# Altium schematic sheet 10_AD1.SchDoc
size A4; PageSetup: Record=PageOptions|CenterHorizontal=True|CenterVertical=True|PrintScale=0.97|XCorrection=1.00|YCorrection=1.00|PrintKind=0|BorderSize=5000000|LeftOffset=0|BottomOffset=0|Orientation=2|PaperLength=1000|PaperWidth=1000|Scale=100|PaperSource=7|PrintQuality=-4|MediaType=1|DitherType=10|PaperKind=A4|PrintScaleMode=1
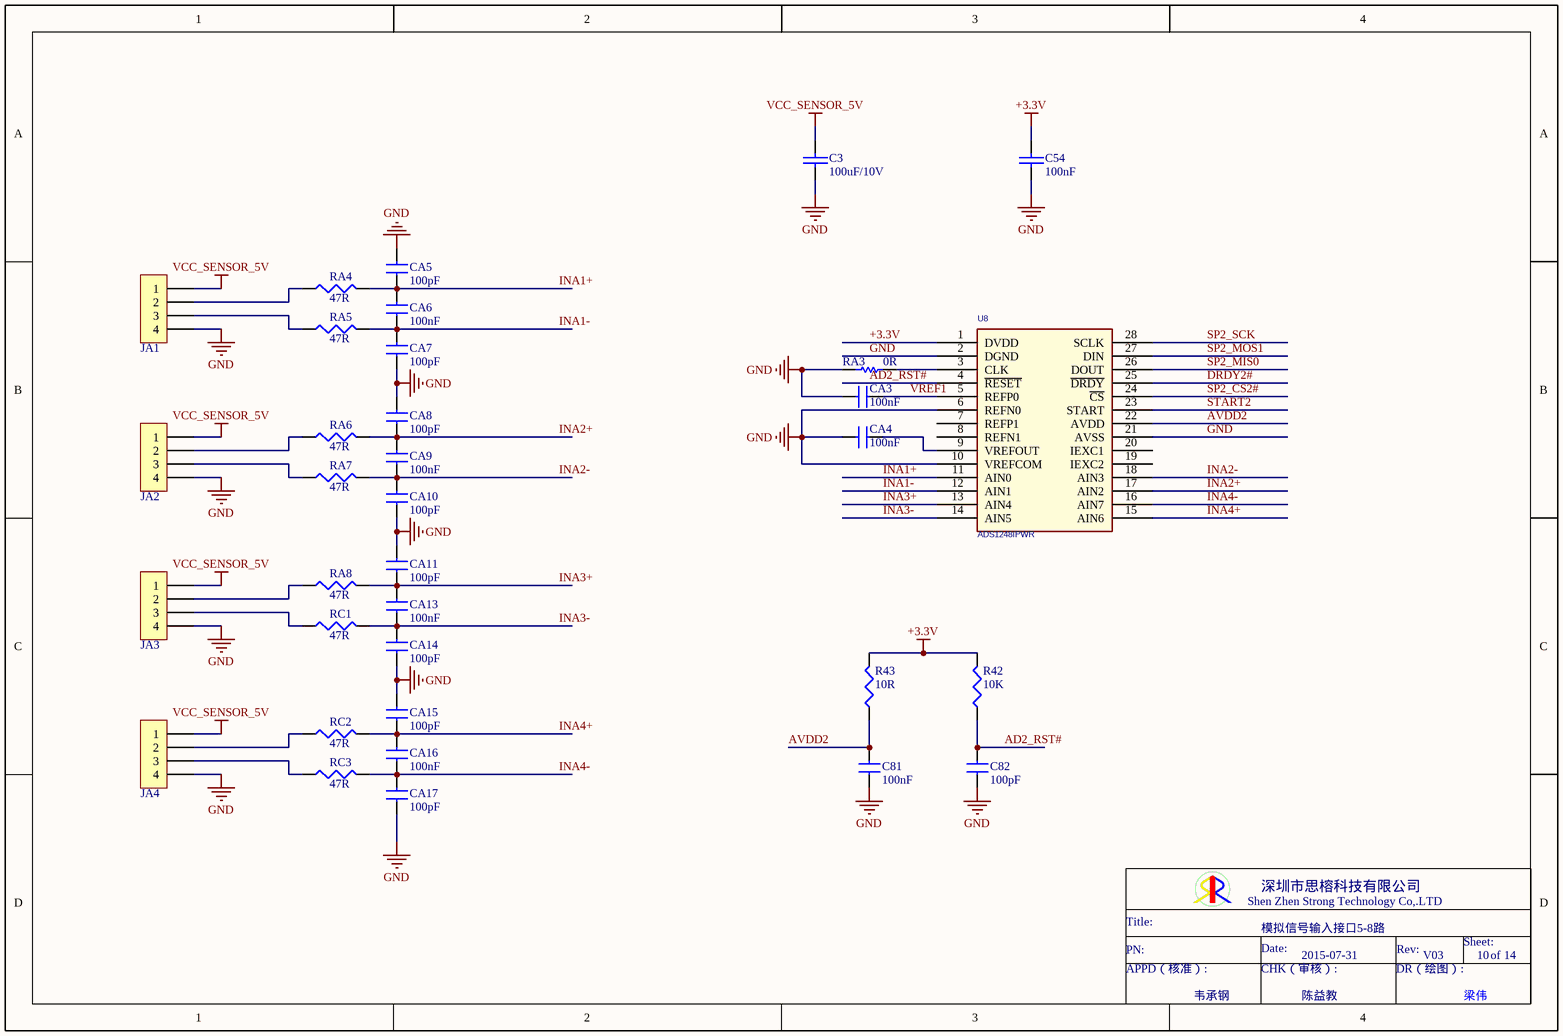
[diagram p0: 10_AD1.SchDoc]

## Parts
C3  100uF/10V  [6032]
C54  100nF  [0603C]
C81  100nF  [0603C]
C82  100pF  [0603C]
CA3  100nF  [0805C]
CA4  100nF  [0805C]
CA5  100pF  [0603C]
CA6  100nF  [0603C]
CA7  100pF  [0603C]
CA8  100pF  [0603C]
CA9  100nF  [0603C]
CA10  100pF  [0603C]
CA11  100pF  [0603C]
CA13  100nF  [0603C]
CA14  100pF  [0603C]
CA15  100pF  [0603C]
CA16  100nF  [0603C]
CA17  100pF  [0603C]
JA1  XH-4A  [CN4-2.54]  (value not drawn)
JA2  XH-4A  [CN4-2.54]  (value not drawn)
JA3  XH-4A  [CN4-2.54]  (value not drawn)
JA4  XH-4A  [CN4-2.54]  (value not drawn)
R42  10K  [0603R]
R43  10R  [0603R]
RA3  0R  [0603R]
RA4  47R  [0603R]
RA5  47R  [0603R]
RA6  47R  [0603R]
RA7  47R  [0603R]
RA8  47R  [0603R]
RC1  47R  [0603R]
RC2  47R  [0603R]
RC3  47R  [0603R]
U8  ADS1248IPWR  [SOIC28]

## Nets
+3.3V: C54.1 R42.2 R43.2 U8.1(DVDD)
GND: C3.2 C54.2 C81.2 C82.2 CA3.2 CA4.2 CA5.1 CA7.2 CA8.1 CA10.2 CA11.1 CA14.2 CA15.1 CA17.2 JA1.4 JA2.4 JA3.4 JA4.4 RA3.1 U8.2(DGND) U8.6(REFN0) U8.10(VREFCOM) U8.21(AVSS)
VCC_SENSOR_5V: C3.1 JA1.1 JA2.1 JA3.1 JA4.1
AD2_RST#: C82.1 R42.1 U8.4(~{RESET})
AVDD2: C81.1 R43.1 U8.22(AVDD)
DRDY2#: U8.25(~{DRDY})
INA1+: CA5.2 CA6.1 RA4.2 U8.11(AIN0)
INA1-: CA6.2 CA7.1 RA5.2 U8.12(AIN1)
INA2+: CA8.2 CA9.1 RA6.2 U8.17(AIN2)
INA2-: CA9.2 CA10.1 RA7.2 U8.18(AIN3)
INA3+: CA11.2 CA13.1 RA8.2 U8.13(AIN4)
INA3-: CA13.2 CA14.1 RC1.2 U8.14(AIN5)
INA4+: CA15.2 CA16.1 RC2.2 U8.15(AIN6)
INA4-: CA16.2 CA17.1 RC3.2 U8.16(AIN7)
SP2_CS2#: U8.24(~{CS})
SP2_MIS0: U8.26(DOUT)
SP2_MOS1: U8.27(DIN)
SP2_SCK: U8.28(SCLK)
START2: U8.23(START)
VREF1: CA3.1 U8.5(REFP0)
NetCA4_1: CA4.1 U8.9(VREFOUT)
NetJA1_2: JA1.2 RA4.1
NetJA1_3: JA1.3 RA5.1
NetJA2_2: JA2.2 RA6.1
NetJA2_3: JA2.3 RA7.1
NetJA3_2: JA3.2 RA8.1
NetJA3_3: JA3.3 RC1.1
NetJA4_2: JA4.2 RC2.1
NetJA4_3: JA4.3 RC3.1
NetRA3_2: RA3.2 U8.3(CLK)

Not connected (* = marked no-connect by the designer): U8 7(REFP1) 8(REFN1) 19(IEXC2) 20(IEXC1)

## Notes on the sheet
- 模拟信号输入接口5-8路
- 2015-07-31
- V03
- 10
- 14
- 韦承钢
- 陈益教
- Shen Zhen Strong Technology Co,.LTD
- 深圳市思榕科技有限公司
- Title:
- PN:
- APPD（核准）:
- Date:
- CHK（审核）:
- DR（绘图）:
- Rev:
- Sheet:
- of
- 梁伟

## Library data of the parts
C3 C54 = CAP: Capacitor
C81 CA3 CA4 CA6 CA9 CA13 CA16 = 电容: Capacitor; Value: 100nF
C82 CA5 CA7 CA8 CA10 CA11 CA14 CA15 CA17 = 电容: Capacitor; Value: 100nF
JA1-JA4 = CON4
R42 R43 RA4-RA8 RC1-RC3 = RES1
RA3 = RES
U8 = ADS1248IPWR: 24ADC; Part Class: ICS - LOGIC; Mfr Code: TI; Manufacturer: Texas Instruments; Manufacturer Part Num: SN74CBTD3384CDBRE4; DESCRIPTION: IC - 10 BIT FET BUS SWITCH; Item Num: P01-13010R; Num Pins: 24; RoHS Compliant: 1